# Altium schematic sheet 12 SWITCH & LED.SchDoc
size 513 x 386 mm
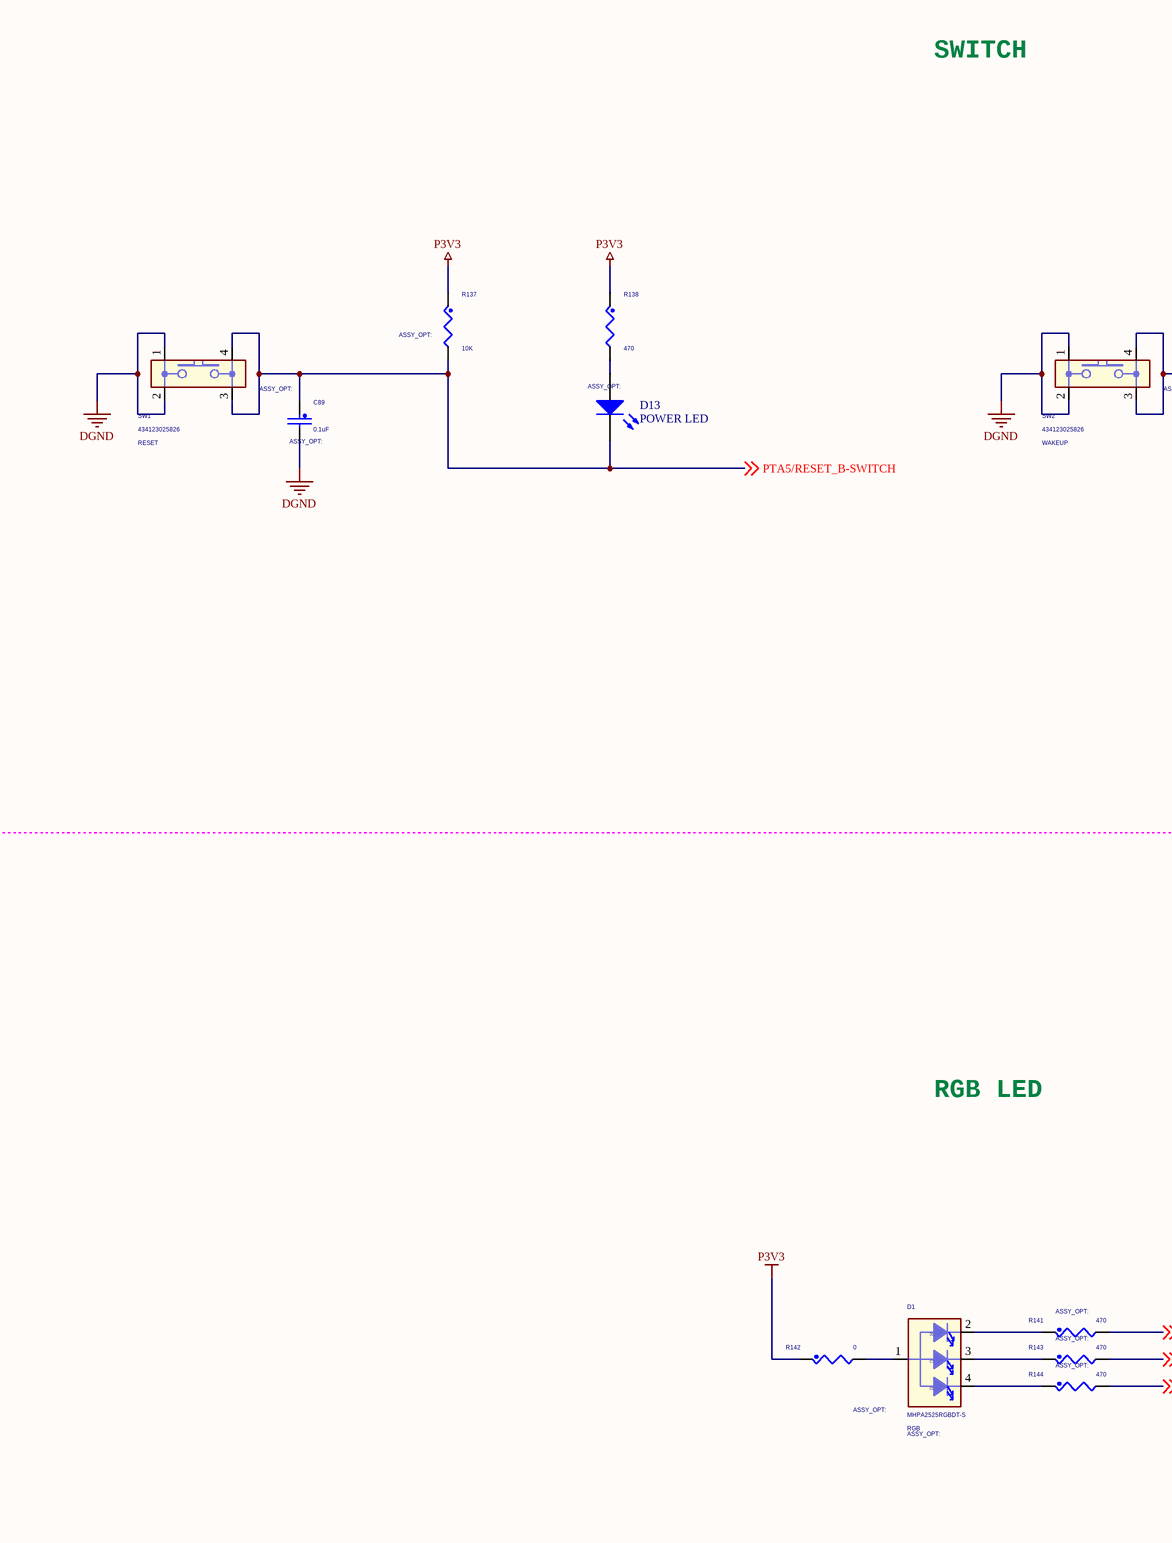
[diagram p0: 12 SWITCH & LED.SchDoc, left]
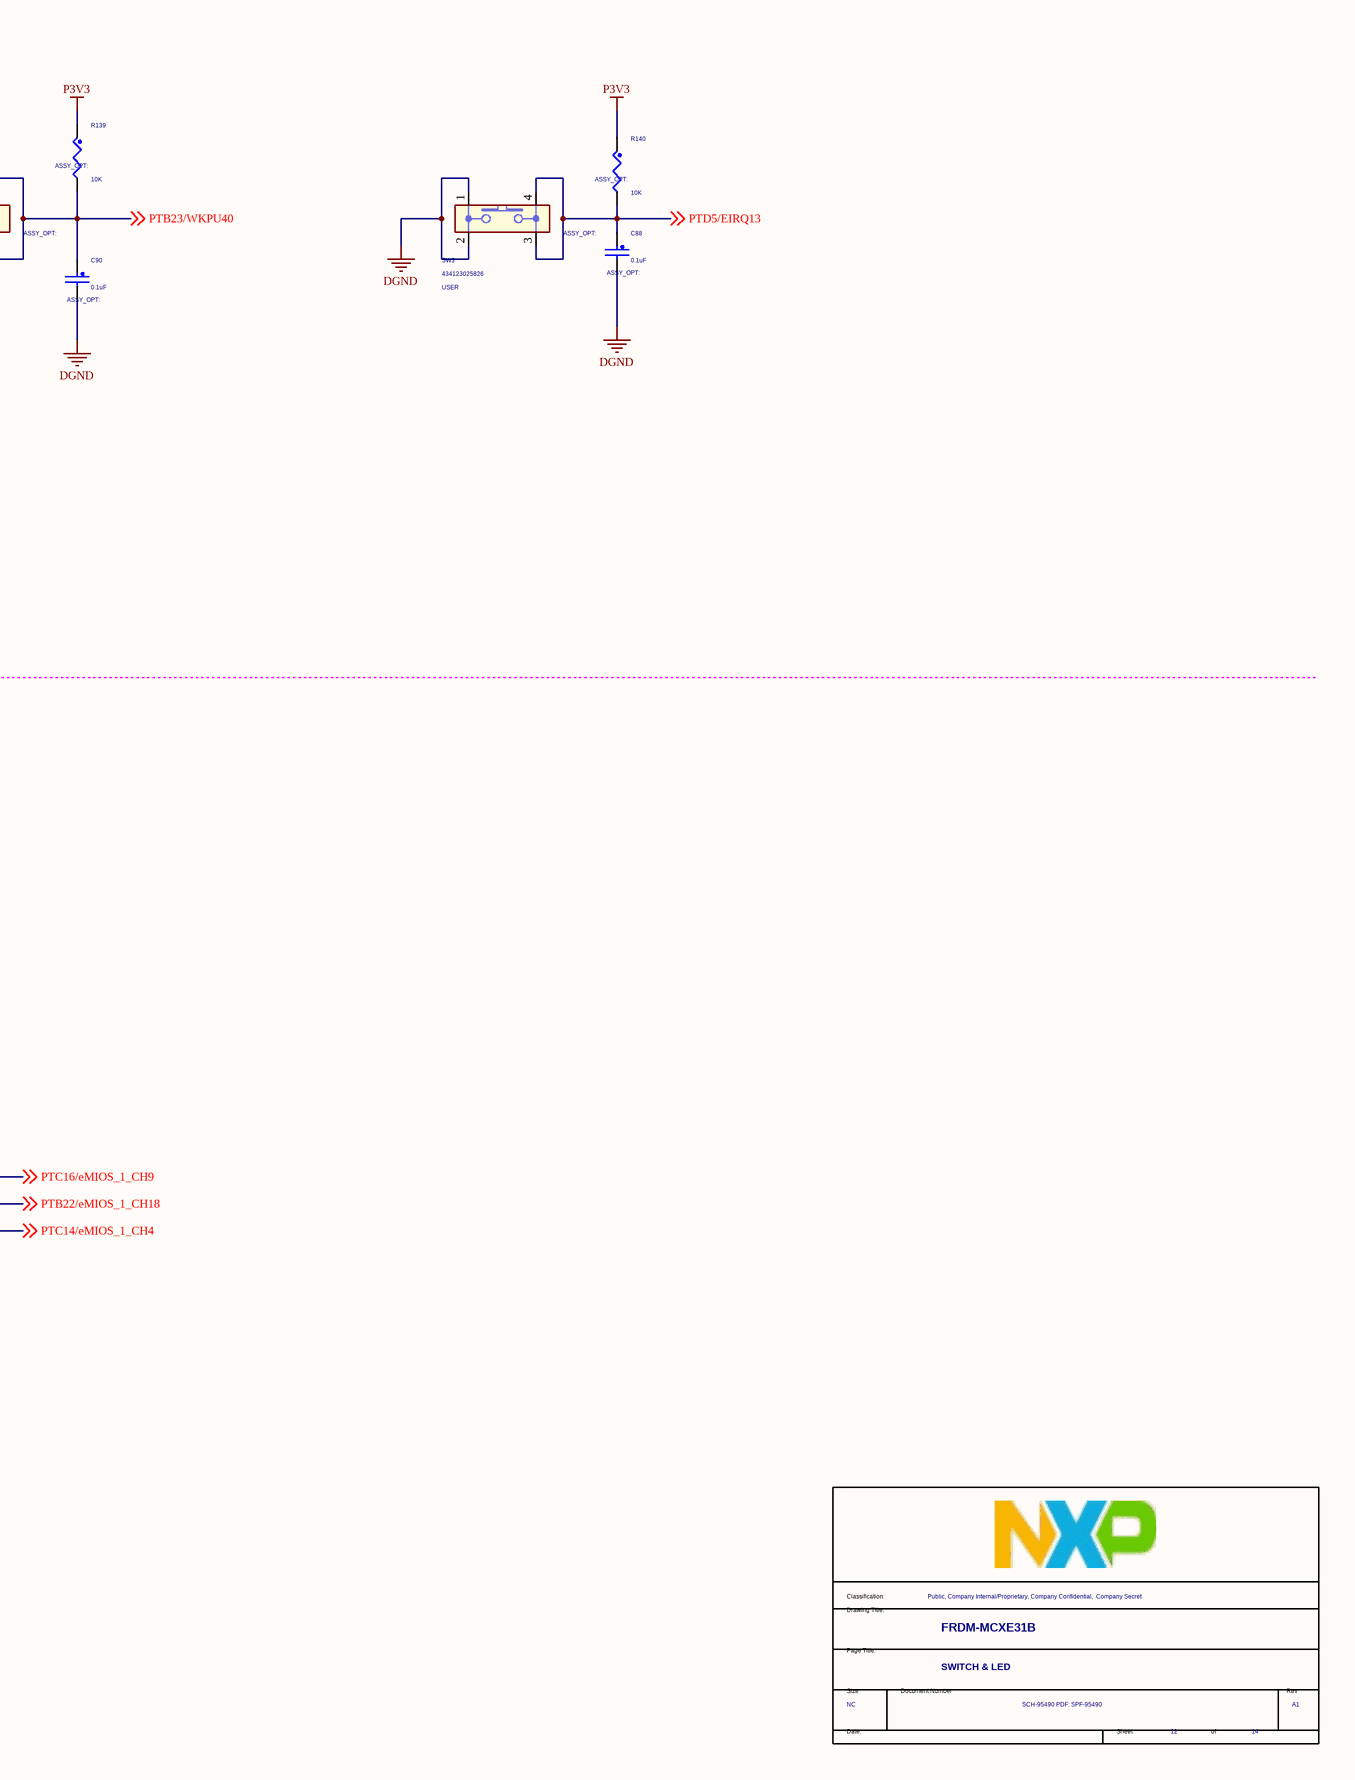
[diagram p1: 12 SWITCH & LED.SchDoc, right]

## Parts
*  Title: FRDM-MCXE31B  RevCode: A1  PageTitle: SWITCH & LED  Page Size: NC  Page Number: 12  Page Count: 14  Doc: SCH-95490 PDF: SPF-95490  Classification: Public, Company Internal/Proprietary, Company Confidential,  Company Secret  (hidden comment: TitleBlock_FS)  (graphical)
C88  0.1uF  [CC0402_25]
C89  0.1uF  [CC0402_25]
C90  0.1uF  [CC0402_25]
D1  MFG_PN01: MHPA2525RGBDT-S  [led4_2p7x2p6_sm]  (hidden comment: RGB)
D13  POWER LED  [LED 0603R]
R137  10K  [RC0402_25]
R138  470  [RC0402_25]
R139  10K  [RC0402_25]
R140  10K  [RC0402_25]
R141  470  [RC0402_25]
R142  0  [RC0603_OV]
R143  470  [RC0402_25]
R144  470  [RC0402_25]
SW1  SILK: RESET  MFG_PN01: 434123025826  [SW-SMD_4P-L5.1-W5.1-P3.70-LS6.5-TL_H1.5]  (hidden comment: SW SPST NO)
SW2  MFG_PN01: 434123025826  SILK: WAKEUP  [SW-SMD_4P-L5.1-W5.1-P3.70-LS6.5-TL_H1.5]  (hidden comment: SW SPST NO)
SW3  SILK: USER  MFG_PN01: 434123025826  [SW-SMD_4P-L5.1-W5.1-P3.70-LS6.5-TL_H1.5]  (hidden comment: SW SPST NO)

## Nets
DGND: C88.2 C89.2 C90.2 SW1.1 SW1.2 SW2.1 SW2.2 SW3.1 SW3.2
P3V3: R137.1 R138.1 R139.1 R140.1 R142.1
PTA5/RESET_B-SWITCH: C89.1 D13.2(K) R137.2 SW1.3 SW1.4 ; off-sheet PTA5/RESET_B-SWITCH
PTB22/eMIOS_1_CH18: R143.2 ; off-sheet PTB22/eMIOS_1_CH18
PTB23/WKPU40: C90.1 R139.2 SW2.3 SW2.4 ; off-sheet PTB23/WKPU40
PTC14/eMIOS_1_CH4: R144.2 ; off-sheet PTC14/eMIOS_1_CH4
PTC16/eMIOS_1_CH9: R141.2 ; off-sheet PTC16/eMIOS_1_CH9
PTD5/EIRQ13: C88.1 R140.2 SW3.3 SW3.4 ; off-sheet PTD5/EIRQ13
NetD1_1: D1.1(ANODE) R142.2
NetD1_2: D1.2(CATHODE1) R141.1
NetD1_3: D1.3(CATHODE2) R143.1
NetD1_4: D1.4(CATHODE3) R144.1
NetD13_1: D13.1(A) R138.2

## Notes on the sheet
- SWITCH
- RGB LED
- (in symbol LRTBR48G_4P) R; G; B
- (in symbol TitleBlock_FS) Classification:; Drawing Title:; Page Title:; Size; Document Number; Rev; Date:; Sheet; of

## Library data of the parts
* = TitleBlock_FS: Classification: Company Internal/Proprietary; OrgName: NXP Semiconductors; OrgAddr1: 6501 William Cannon Drive West; OrgAddr2: Austin, TX 78735-8598; Variant Name: <Core Design>; Page Create Date: March  8, 1995
C88 C90 = CAP_NP: CAP CER 0.1UF 16V 10% X7R 0402; CLASS: DISCRETE; Temp Range: -55C to +125C; SIGNAL_MODEL: DEFAULT_CAPACITOR_100000pF_2_1; AGILE_PN: 150-75182; MFG_NAME01: Samsung Electro-Mechanics; MFG_PN01: CL05B104KO5NNNC; CAD_APPROVED: Yes; FPLIST: CC0402_25,CC0402_HD,0402_CC,CAPC0402_L,cc0402_lamp3; Temp_Range: -55癈 to +85癈; 3D_Mechanical_Footprint_File: http://fcl.am.freescale.net/ALLEGRO/step/cc0402_25.STEP; Rated Voltage: 16V; Tolerance: 10%; ROHS: NULL; HEIGHT: 0.635mm; TOL: 10%; VOLTAGE: 16V
C89 = CAP_NP: CAP CER 0.1UF 16V 10% X7R 0402; CLASS: DISCRETE; Temp_Range: -55癈 to +85癈; FPLIST: CC0402_25,CC0402_HD,0402_CC,CAPC0402_L,cc0402_lamp3; CAD_APPROVED: Yes; MFG_PN01: CL05B104KO5NNNC; MFG_NAME01: Samsung Electro-Mechanics; AGILE_PN: 150-75182; SIGNAL_MODEL: DEFAULT_CAPACITOR_100000pF_2_1; Temp Range: -55C to +125C; VOLTAGE: 16V; TOL: 10%; HEIGHT: 0.635mm; ROHS: NULL; Tolerance: 10%; Rated Voltage: 16V; 3D_Mechanical_Footprint_File: http://fcl.am.freescale.net/ALLEGRO/step/cc0402_25.STEP
D1 = LRTBR48G_4P: LED RED/GRN/BL TRI 20/20/20MA SMT; CLASS: IC; AGILE_PN: 370-76899; CAD_APPROVED: YES; Temp Range: -40 to +100; MFG_NAME01: Lianyungang Meihua Electronics Technology Co.,Ltd; HEIGHT: 2.14mm; SILK: RGB; 3D_Mechanical_Footprint_File: http://fcl.am.freescale.net/ALLEGRO/step/led4_2p7x2p6_sm.step
D13 = LED-SMT
R137 = RES: RES MF 10K 1/16W 5% 0402; CLASS: DISCRETE; Temp_Range: ?5 癈 to +155 癈; FPLIST: RC0402_25,RC0402_HD,0402_CC; CAD_APPROVED: Yes; MFG_PN01: CR0402-JW-103GLF; MFG_NAME01: BOURNS; AGILE_PN: 470-75557; SIGNAL_MODEL: DEFAULT_RESISTOR_10000OHM_2_1; HEIGHT: 0.4MM; TOL: 5%; ROHS: NULL; Tolerance: 5%
R138 R143 R144 = RES: RES MF 470 OHM 1/16W 5% 0402; CLASS: DISCRETE; TOL: 1%; AGILE_PN: 470-30315; MFG_NAME01: PANASONIC; MFG_PN01: ERJ2GEJ471X; CAD_APPROVED: Yes; FPLIST: RC0402_25,RC0402_HD,0402_CC; SIGNAL_MODEL: DEFAULT_RESISTOR_430.000000OHM_2_1; Temp_Range: -55&#8451; to 155&#8451;; HEIGHT: 0.45; Tolerance: 5%; ROHS: Yes
R139 R140 = RES: RES MF 10K 1/16W 5% 0402; CLASS: DISCRETE; Temp_Range: ?5 癈 to +155 癈; SIGNAL_MODEL: DEFAULT_RESISTOR_10000OHM_2_1; AGILE_PN: 470-75557; MFG_NAME01: BOURNS; MFG_PN01: CR0402-JW-103GLF; CAD_APPROVED: Yes; FPLIST: RC0402_25,RC0402_HD,0402_CC; Tolerance: 5%; ROHS: NULL; TOL: 5%; HEIGHT: 0.4MM
R141 = RES: RES MF 470 OHM 1/16W 5% 0402; CLASS: DISCRETE; Temp_Range: -55&#8451; to 155&#8451;; SIGNAL_MODEL: DEFAULT_RESISTOR_430.000000OHM_2_1; FPLIST: RC0402_25,RC0402_HD,0402_CC; CAD_APPROVED: Yes; MFG_PN01: ERJ2GEJ471X; MFG_NAME01: PANASONIC; AGILE_PN: 470-30315; TOL: 1%; ROHS: Yes; Tolerance: 5%; HEIGHT: 0.45
R142 = RES: RES MF ZERO OHM 1/10W -- 0603; CLASS: DISCRETE; MFG_PN01: CRCW06030000Z0EAC; MFG_NAME01: VISHAY; Temp Range: –55 °C to +155 °C; CAD_APPROVED: Yes; FPLIST: RC0603_OV,RC0603,R603-X2,r603-x2_b,0603_CC,IND_0603HP_NSP,CC0603_OV_NSP; AGILE_PN: 470-80866; ROHS: NULL; HEIGHT: 0.6
SW1 SW3 = SW_PSHBT_SPST_2: SW SP PB 50mA 16V SMT; CLASS: IC; AGILE_PN: 510-78653; CAD_APPROVED: Yes; Temp Range: -40C to +85C; MFG_NAME01: WURTH ELEKTRONIK EISOS GMBH & CO. KG (ELECTRONIC & ELECTROMEHANICAL COMP); HEIGHT: 2.60; ROHS: Yes; 3D_Mechanical_Footprint_File: http://fcl.am.freescale.net/ALLEGRO/step/sw4_4p15_4p2x3p2_sm.STEP
SW2 = SW_PSHBT_SPST_2: SW SP PB 50mA 16V SMT; CLASS: IC; MFG_NAME01: WURTH ELEKTRONIK EISOS GMBH & CO. KG (ELECTRONIC & ELECTROMEHANICAL COMP); Temp Range: -40C to +85C; CAD_APPROVED: Yes; AGILE_PN: 510-78653; 3D_Mechanical_Footprint_File: http://fcl.am.freescale.net/ALLEGRO/step/sw4_4p15_4p2x3p2_sm.STEP; ROHS: Yes; HEIGHT: 2.60